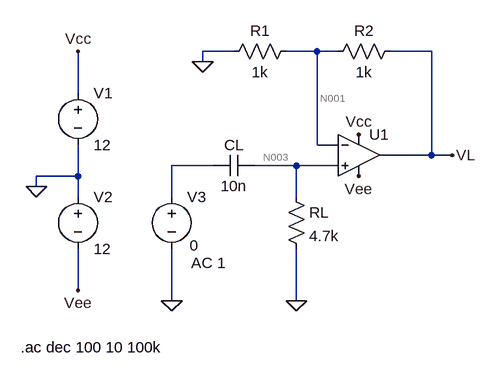
[diagram p0: schematic p6_prev3.asc]
p6_prev3.asc, the LTspice schematic file:
Version 4
SHEET 1 880 680
WIRE 272 16 224 16
WIRE 400 16 352 16
WIRE 432 16 400 16
WIRE 576 16 512 16
WIRE 224 32 224 16
WIRE 32 80 32 16
WIRE 400 160 400 16
WIRE 432 160 400 160
WIRE 576 176 576 16
WIRE 576 176 496 176
WIRE 608 176 576 176
WIRE 240 192 176 192
WIRE 368 192 304 192
WIRE 432 192 368 192
WIRE 32 208 32 160
WIRE 32 208 -32 208
WIRE -32 224 -32 208
WIRE 32 240 32 208
WIRE 176 240 176 192
WIRE 368 240 368 192
WIRE 32 384 32 320
WIRE 176 400 176 320
WIRE 368 400 368 320
FLAG -32 224 0
FLAG 176 400 0
FLAG 224 32 0
FLAG 32 16 Vcc
FLAG 32 384 Vee
FLAG 464 144 Vcc
FLAG 464 208 Vee
FLAG 368 400 0
FLAG 608 176 VL
SYMBOL voltage 32 64 R0
WINDOW 123 0 0 Left 0
WINDOW 39 0 0 Left 0
SYMATTR InstName V1
SYMATTR Value 12
SYMBOL voltage 32 224 R0
WINDOW 123 0 0 Left 0
WINDOW 39 0 0 Left 0
SYMATTR InstName V2
SYMATTR Value 12
SYMBOL voltage 176 224 R0
WINDOW 3 28 91 Left 2
WINDOW 123 30 118 Left 2
WINDOW 39 0 0 Left 0
SYMATTR Value 0
SYMATTR Value2 AC 1
SYMATTR InstName V3
SYMBOL res 368 0 R90
WINDOW 0 0 56 VBottom 2
WINDOW 3 32 56 VTop 2
SYMATTR InstName R1
SYMATTR Value 1k
SYMBOL res 528 0 R90
WINDOW 0 0 56 VBottom 2
WINDOW 3 32 56 VTop 2
SYMATTR InstName R2
SYMATTR Value 1k
SYMBOL OpAmps\\UniversalOpamp2 464 176 R0
SYMATTR InstName U1
SYMBOL res 352 224 R0
SYMATTR InstName RL
SYMATTR Value 4.7k
SYMBOL cap 304 176 R90
WINDOW 0 0 32 VBottom 2
WINDOW 3 32 32 VTop 2
SYMATTR InstName CL
SYMATTR Value 10n
TEXT -56 472 Left 2 !.ac dec 100 10 100k

The netlist it stands for:
* p6_prev3.asc
V1 Vcc 0 12
V2 0 Vee 12
V3 N002 0 0 AC 1
R1 N001 0 1k
R2 VL N001 1k
XU1 N003 N001 Vcc Vee VL level.2 Avol=1Meg GBW=10Meg Slew=10Meg ilimit=25m rail=0 Vos=0 phimargin=45 en=0 enk=0 in=0 ink=0 Rin=500Meg  ; pins IN+ IN- V+ V- OUT
RL N003 0 4.7k
CL N003 N002 10n
.ac dec 100 10 100k
.lib UniversalOpamps2.sub
.backanno
.end

* Results of the author's LTspice run, read from the files saved beside the schematic
* Operating Point, zero values left out:
*   V(vcc) = 12 V
*   V(vee) = -12 V
*   I(V2) = -1.199 mA
*   I(V1) = -1.199 mA
*   Ix(u1:3) = 1.199 mA
*   Ix(u1:4) = -1.199 mA
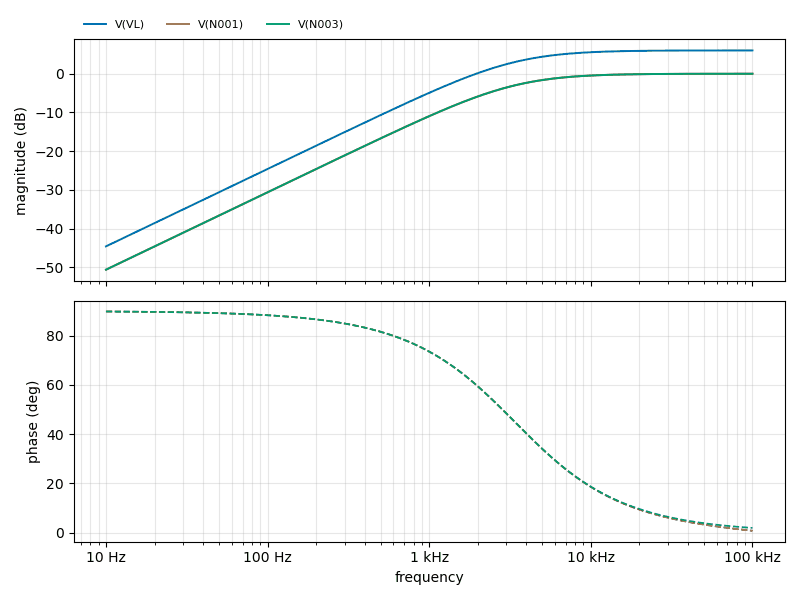
[diagram p1: AC Analysis of p6_prev3.asc, plotted from the saved traces]
* AC Analysis, 1 run:
*   V(VL): -44.57 dB at 10 Hz, 6.01 dB at 100 kHz, peak 6.01 dB at 100 kHz, 3 dB below the peak at 3.381 kHz
*   V(N001): -50.59 dB at 10 Hz, -0.01 dB at 100 kHz, peak -0.01 dB at 100 kHz, 3 dB below the peak at 3.381 kHz
*   V(N003): -50.59 dB at 10 Hz, -0.00 dB at 100 kHz, peak -0.00 dB at 100 kHz, 3 dB below the peak at 3.382 kHz